# EAGLE design Power (EAGLE 7.1.0)
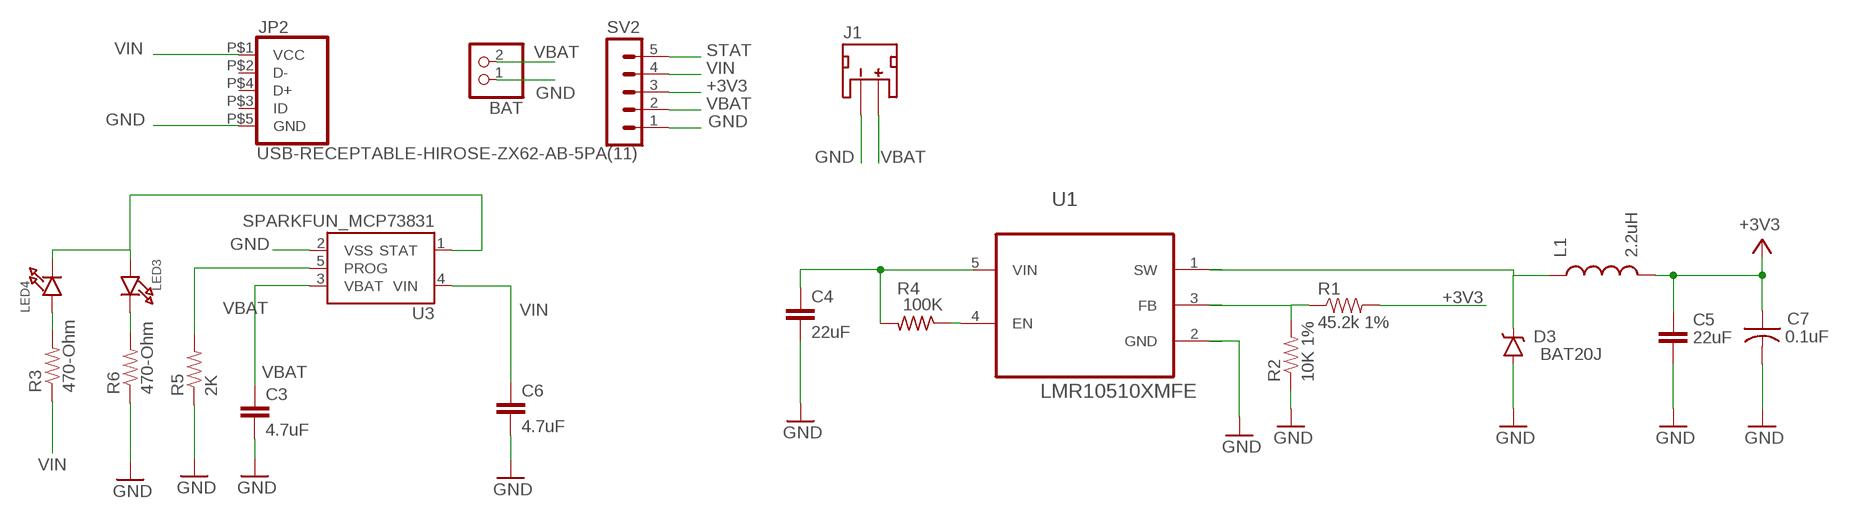
[diagram p0: schematic, sheet 1]

## Parts
BAT  PINHD-1X2  [1X02]
C3  4.7uF  CAP0603-CAP  [0603-CAP]
C4  22uF  C-EUC0603  [C0603]
C5  22uF  C-EUC0603  [C0603]
C6  4.7uF  CAP0603-CAP  [0603-CAP]
C7  0.1uF  C-USC0402  [C0402]
D3  BAT20J  DIODE-SCHOTTKY-BAT20J  [SOD-323]
J1  JST_2MM_MALE  [JST-2-SMD]
JP2  USB-RECEPTABLE-HIROSE-ZX62-AB-5PA(11)  [HIROSE-ZX62-AB-5PA(11)]
L1  2.2uH  INDUCTOR-SPARKFUN0805  [0805]
LED3  LED0603  [CHIPLED_0603]
LED4  LED0603  [CHIPLED_0603]
R1  45.2k 1%  RESISTOR0603  [0603-RES]
R2  10K 1%  RESISTOR0603  [0603-RES]
R3  470-Ohm  RESISTOR0603  [0603-RES]
R4  100K  R-US_R0402  [R0402]
R5  2K  RESISTOR0603  [0603-RES]
R6  470-Ohm  RESISTOR0603  [0603-RES]
SV2  MA05-1  [MA05-1]
U1  LMR10510XMFE  [SOT95P270X145-5N]
U3  SPARKFUN_MCP73831  [SPARKFUN_SOT23-5]

## Nets
+3V3: C5.1 C7.1 L1.2 R1.2 SV2.3
FB: R1.1 R2.2 U1.3(FB)
GND [vcc]: BAT.1 C3.2 C4.2 C5.2 C6.2 C7.2 D3.A J1.1(-) JP2.P$5(GND) R2.1 R5.1 R6.1 SV2.1 U1.2(GND) U3.2(VSS)
N$1: LED4.A R3.2
N$2: R4.1 U1.4(EN)
N$5: LED3.C R6.2
PROG: R5.2 U3.5(PROG)
STAT: LED3.A LED4.C SV2.5 U3.1(STAT)
SW: D3.C L1.1 U1.1(SW)
VBAT [vcc]: BAT.2 C3.1 C4.1 J1.2(+) R4.2 SV2.2 U1.5(VIN) U3.3(VBAT)
VIN: C6.1 JP2.P$1(VCC) R3.1 SV2.4 U3.4(VIN)
Unconnected: J1.NC1(PAD1) J1.NC2(PAD2) JP2.P$2(D-) JP2.P$3(ID) JP2.P$4(D+)

## Library data of the parts
BAT = pinhead:PINHD-1X2: PIN HEADER
C3 C6 = SparkFun-Capacitors:CAP: Capacitor Standard 0603 ceramic capacitor, and 0.1" leaded capacitor.
C4 C5 = rcl:C-EU: CAPACITOR, European symbol
C7 = adafruit:C-US: CAPACITOR, American symbol
D3 = SparkFun-DiscreteSemi:DIODE-SCHOTTKY: Schottky diodes in SFE's production catalog BAT20J 1A 23V 0.62Vf RB751 120mA 40V 0.37Vf PMEG4005EJ 0.5A 40V 0.42Vf MBRA140 1A 40V 0.5Vf B340A 3A 40V SMA; PROD_ID: DIO-11623
J1 = SparkFun-Connectors:JST_2MM_MALE: Mates to single-cell LiPo batteries. CONN-08352; PROD_ID: CONN-08352
JP2 = daspilker:USB-RECEPTABLE: USB Receptable
L1 = Spark:INDUCTOR-SPARKFUN: Inductors Basic Inductor/Choke - 0603 and 1206. Footprints are not proven and vary greatly between part numbers. SRN6045- 33uH, 20% 1.4A
LED3 LED4 = microbuilder:LED: LED 0603 - 0603 Surface Mount Package 2mA: Green LED - Low Power (3.9mcd, 2ma, 1.7Vf) - Digikey: 475-2709-2-ND Orange LED - Low Power (9.8mcd, 2ma, 1.8Vf) - Digikey: 475-1194-2-ND Red LED - Low Power (5mcd, 2ma, 1.8Vf) - Digikey: 475-1195-2-ND Yellow LED - Low Power (7mcd, 2ma, 1.8Vf) - Digikey: 475-1196-2-ND 5mA: Blue LED - Low Power (17mcd, 5ma, 2.9Vf) - Digikey: LNJ937W8CRACT-ND 0805 - 0805 Surface Mount Package 2mA: Red LED (8.8mcd, 2mA, 1.8Vf, Clear) - Low Power [Digikey: 475-2510-1-ND] Green LED (5mcd, 2mA, 1.8Vf, Clear) - Low Power [Digikey: 475-2730-1-ND] Yellow LED (11.3mcd, 2mA, 1.8Vf, Clear) - Low Power [Digikey: 475-2555-1-ND] 20mA: Red LED (104mcd, 20mA, Diffused) - LS R976 [Digikey: 475-1278-6-ND] Red LED (12mcd, 20mA, 2.0Vf, Clear) - APT2012EC [Digikey: 754-1128-1-ND] Green LED (15mcd, 20mA, 2.2Vf, Clear) - APT2012GC [Digikey: 754-1131-1-ND] Orange LED (160mcd, 20mA, 2.1Vf, Clear) - APT2012SECK [Digikey: 754-1130-1-ND] 1206 - 1206 Surface Mount Package Green LED (26mcd, 20mA, Diffused) - LG N971 [Digikey: 475-1407-6-ND] Red LED (15mcd, 20mA, Diffused) - LH N974 [Digikey: 475-1416-6-ND]
R1-R3 R5 R6 = SparkFun-Resistors:RESISTOR: Resistor Basic schematic elements and footprints for 0603, 1206, and PTH resistors.
R4 = adafruit:R-US_: RESISTOR, American symbol
SV2 = con-lstb:MA05-1: PIN HEADER; OC_FARNELL: unknown; OC_NEWARK: unknown
U1 = Microchip_By_element14_Batch_1:LMR10510XMFE
U3 = DECADE-libraries:SPARKFUN_MCP73831: Microchip s MCP73831 Miniature single cell, fully integrated Li-Ion, Li-polymer charge management controller http://ww1.microchip.com/downloads/en/DeviceDoc/21984a.pdf'

## Net classes
2 RF: width 0.381 mm, clearance 0.381 mm

## Board
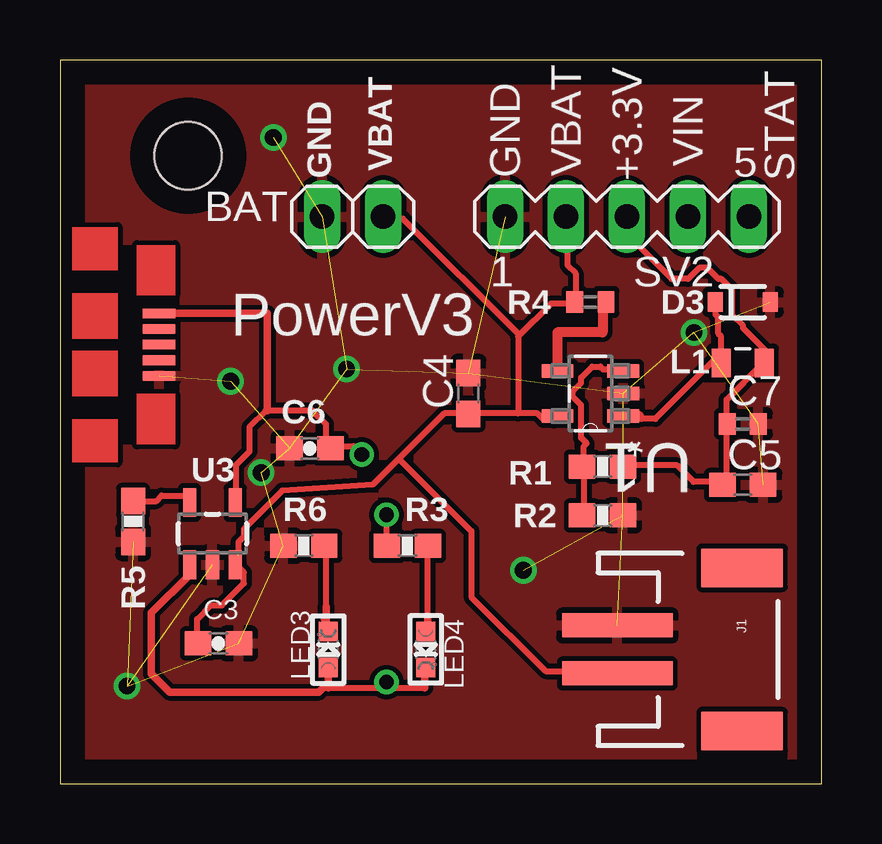
[diagram p1: board, top side]
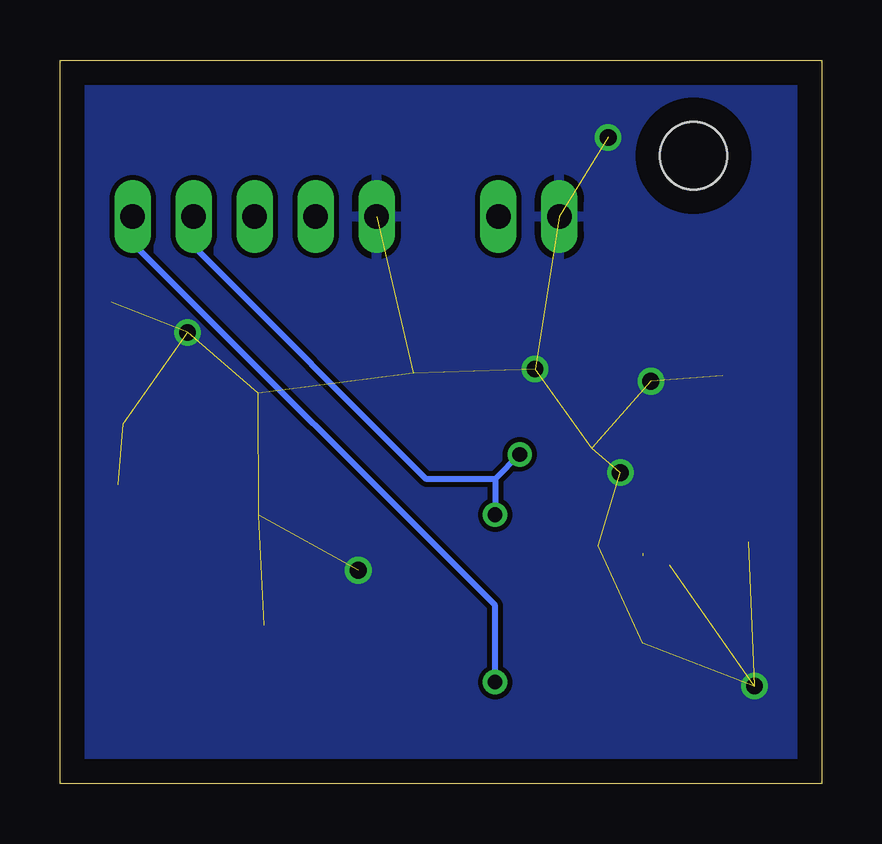
[diagram p2: board, bottom side, seen from below]

Size 31.73 x 30.15 mm. Coordinates in mm from the lower left corner, seen from the top.
Outline: 0,0 31.73,0 31.73,30.15 0,30.15 0,0
Copper layers (1*16): Top 0.035mm / dielectric 1.5mm / Bottom 0.035mm
Design rules "default": minimum track width 10mil, minimum drill 24mil, track to track 8mil, track to pad 8mil, pad to pad 8mil, via to via 8mil, smd to smd 8mil, copper to edge 40mil, drill to drill 8mil, minimum pad ring 10mil, minimum via ring 8mil, stop-mask expansion 4mil, vias tented up to drill 0mil, thermal gap 10mil
Holes 2.8 mm at 5.33,26.16

### Footprints (pad centres in the part's own frame; a part is rotated, then mirrored left to right if it is on the bottom)
1X02 = drill 1.016 long: 1 -1.27,0; 2 1.27,0
0603-CAP = smd 1.1 x 1: 1 -0.85,0; 2 0.85,0
C0603 = smd 1.1 x 1: 1 -0.85,0; 2 0.85,0
C0402 = smd 0.7 x 0.9: 1 -0.65,0; 2 0.65,0
SOD-323 = smd 0.63 x 0.83: A 1.15,0; C -1.15,0
JST-2-SMD = smd 1 x 4.6: 1 -1,-3.7; 2 1,-3.7 | smd 1.6 x 3.4: NC1 -3.4,1.5; NC2 3.4,1.5
HIROSE-ZX62-AB-5PA(11) = smd 0.4 x 1.35 bottom: P$1 1.3,4.125; P$2 0.65,4.125; P$3 0,4.125; P$4 -0.65,4.125; P$5 -1.3,4.125
0805 = smd 0.8 x 1.2: 1 -0.9,0; 2 0.9,0
CHIPLED_0603 = smd 0.8 x 0.8: A 0,-0.75; C 0,0.75
0603-RES = smd 1.1 x 1: 1 -0.85,0; 2 0.85,0
R0402 = smd 0.7 x 0.9: 1 -0.65,0; 2 0.65,0
MA05-1 = drill 1.016 long: 1 -5.08,0; 2 -2.54,0; 3 0,0; 4 2.54,0; 5 5.08,0
SOT95P270X145-5N = smd 1.321 x 0.559: 1 -1.372,0.94; 2 -1.372,0; 3 -1.372,-0.94; 4 1.372,-0.94; 5 1.372,0.94
SPARKFUN_SOT23-5 = smd 0.55 x 1.2: 1 -0.95,-1.3; 2 0,-1.3; 3 0.95,-1.3; 4 0.95,1.3; 5 -0.95,1.3

### Placement (x,y rotation side)
BAT  12.19,23.62 0 top
C3  6.6,5.84 0 top
C4  17.02,16.26 90 top
C5  28.45,12.45 0 top
C6  10.41,13.97 180 top
C7  28.45,14.99 0 top
D3  28.45,20.07 0 top
J1  26.92,5.59 270 top
JP2  0,18.29 90 bottom
L1  28.45,17.53 0 top
LED3  11.18,5.59 0 top
LED4  15.24,5.59 180 top
R1  22.61,13.21 0 top
R2  22.61,11.18 180 top
R3  14.48,9.91 0 top
R4  22.1,20.07 180 top
R5  3.05,10.92 90 top
R6  10.16,9.91 0 top
SV2  23.62,23.62 0 top
U1  22.1,16.26 180 top
U3  6.35,10.41 0 top

### Tracks (layer width: path | path; a pad name or v marks a point on that pad's centre or on a via)
+3V3
  Top 0.254: R1.2 23.55,13.26 25.72,13.26 26.4,12.57 27.66,12.57 C5.1 27.66,12.46 27.77,12.57 27.77,14.97 C7.1 27.77,15.09 27.77,16 29.26,17.49 L1.2 29.38,17.6 29.38,18.06 28.46,18.97 28.46,19.09 28,19.55 28,20.57 27.55,21.03 27.43,21.03 26.98,21.49 26.63,21.49 26.18,21.03 25.49,21.03 23.66,22.86 23.66,23.55 SV2.3
FB
  Top 0.254: R2.2 21.83,11.2 21.83,13.14 R1.1 21.83,13.26 21.83,14.06 21.95,14.17 21.72,14.4 21.72,15.77 21.37,16.12 21.37,16.34 21.72,16.69 21.72,16.92 22.17,17.37 22.52,17.37 22.63,17.26 23.37,17.26 23.43,17.26
  Top 0.406: U1.3 23.37,17.2 23.37,17.26
GND  (via drill 0.7)  (21 unrouted)
  other vias: 8.89,26.92 11.94,17.27 8.38,12.95 2.79,4.06 19.3,8.89 26.42,18.8 7.11,16.76
  pour Bottom: 0,0 0,31.75 31.75,31.75 31.75,0
  pour Top: 0,33.02 0,0 31.75,0 31.75,33.02
N$1
  Top 0.254: 15.32,6.86 15.32,9.83 R3.2
  Top 0.305: LED4.A 15.32,6.34 15.32,6.86
N$2
  Top 0.406: R4.1 22.61,20.07 22.61,18.8 20.73,18.8 U1.4
N$5
  Top 0.254: 10.97,6.86 11.09,6.97 11.09,7.37 11.09,9.83 R6.2
  Top 0.305: LED3.C 11.09,6.34 11.09,7.37
PROG
  Top 0.254: 5.37,12 4.23,12 4,11.77 3.09,11.77 R5.2
  Top 0.305: U3.5 5.37,11.71 5.37,12
STAT  (via drill 0.61)
  Top 0.254: 10.97,4 11.18,4 13.6,4 | 13.6,4 15.2,4 | v13.6,4.23 13.6,4
  Top 0.305: LED3.A 11.18,4 | LED4.C 15.2,4.84 15.2,4 | U3.1 5.4,8.7 3.81,7.11 3.81,4.57 4.57,3.81 10.78,3.81 10.97,4
  Bottom 0.254: v13.6,4.23 13.6,7.43 28.69,22.52 28.69,23.55 SV2.5
SW
  Top 0.254: D3.C 27.32,20 27.32,19.55 27.43,19.43 27.43,18.75 27.55,18.63 27.55,17.6 L1.1 27.43,17.83 24.8,15.2 24.23,15.2 24.12,15.32
  Top 0.406: U1.1 24.12,15.32
VBAT  (1 unrouted)
  Top 0.254: 7.43,9.49 7.43,9.03 7.66,8.8 7.66,8.34 6.74,7.43 6.29,7.43 5.71,6.86 5.71,5.94 C3.1 | 19.09,15.43 19.89,15.43 20.12,15.2 20.57,15.2 20.69,15.32 | 19.09,15.43 17.03,15.43 C4.1 16.92,15.43 16,15.43 14.12,13.54 | SV2.2 21.14,23.55 21.14,21.6 21.49,21.26 21.49,20.12 R4.2 21.37,20 20.46,20 19.09,18.63 | 19.09,18.63 19.09,15.43 | 7.43,9.6 7.43,10.06 7.66,10.29 7.66,10.6 9.26,12.21 13.03,12.46 14.12,13.54 | BAT.2 13.51,23.55 14.29,23.55 19.09,18.75 19.09,18.63 | 14.12,13.54 17.14,10.52 17.14,7.77 20.23,4.69 23.2,4.69 J1.2
  Top 0.305: U3.3 7.43,9.11 7.43,9.03
  Top 0.406: U1.5 20.57,15.32 20.57,15.2
VIN  (via drill 0.61)
  Top 0.254: 7.32,12.12 7.32,13.26 7.89,13.83 7.89,14.86 8.57,15.54 8.64,15.54 10.52,15.54 11.09,14.97 11.09,14.17 11.2,14.06 C6.1 11.32,14.06 12.23,14.06 v12.57,13.72 | v13.6,11.2 13.6,9.94 R3.1
  Top 0.305: 8.64,15.54 8.64,19.59 JP2.P$1 | 7.32,12.12 7.3,12.12 U3.4
  Bottom 0.254: 13.6,12.69 v13.6,11.2 | v12.57,13.72 13.6,12.69 | 13.6,12.69 16.46,12.69 26.06,22.29 26.06,23.55 SV2.4

### Text on the board
tNames: VBAT | +3.3V | STAT | VBAT | GND | VIN | GND | PowerV3